# EAGLE design OSO-SWAT-A1-0xA (EAGLE 9.4.2)
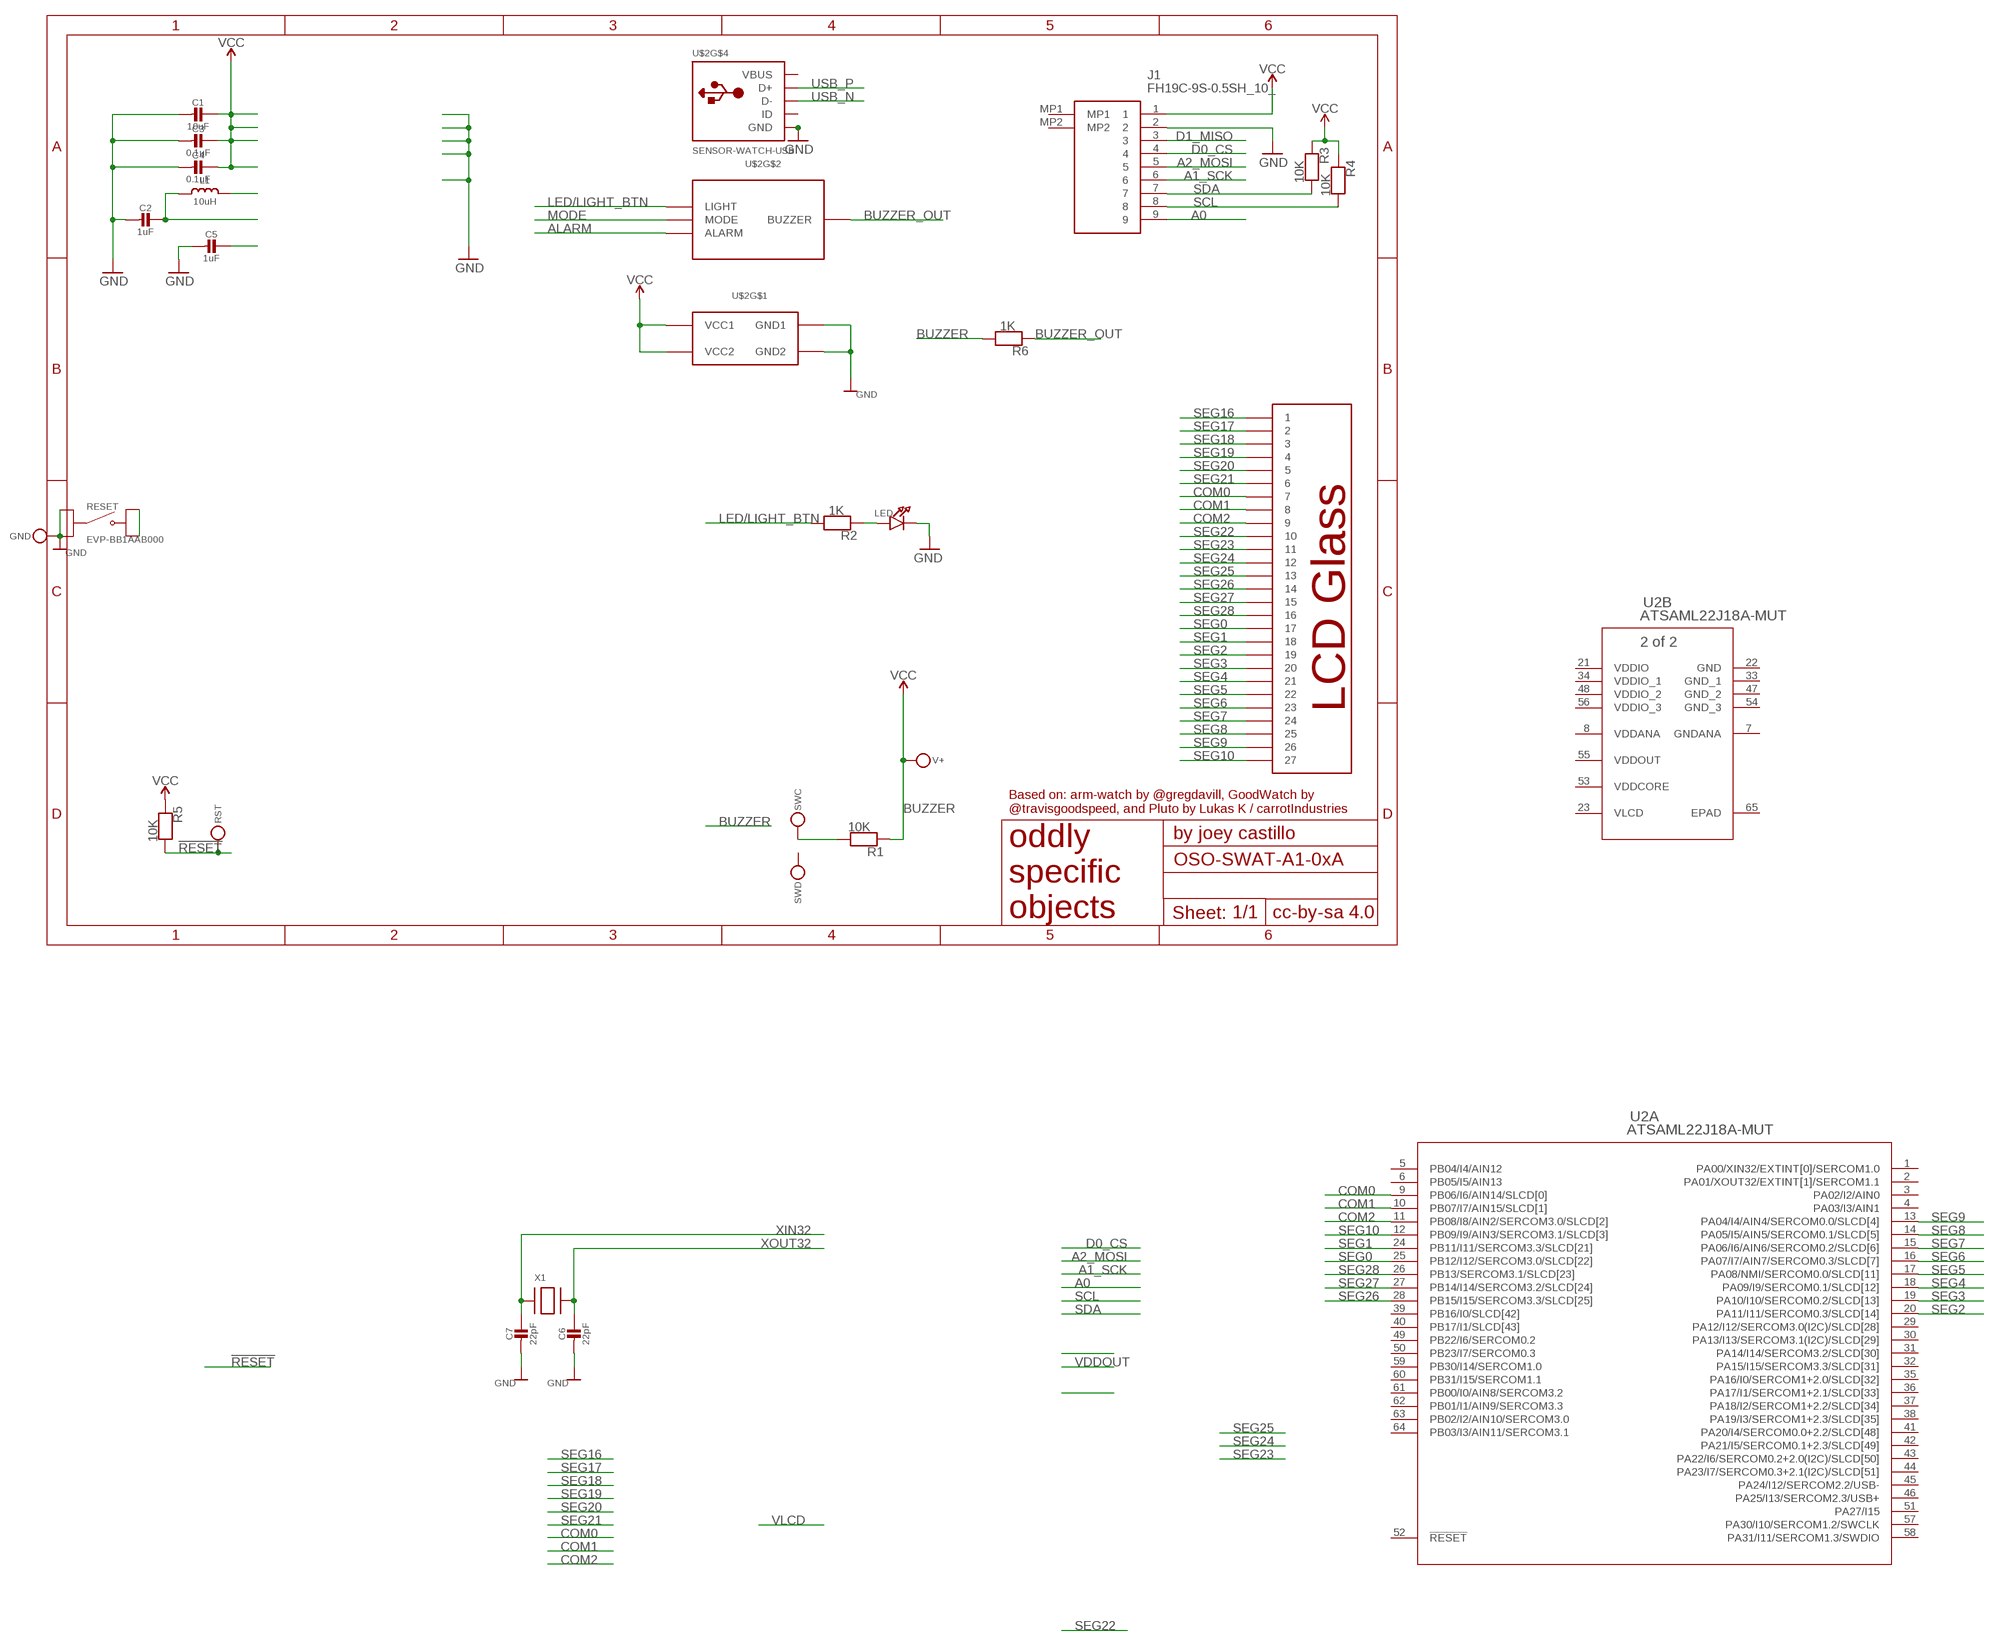
[diagram p0: schematic, sheet 1]

## Parts
C1  10uF  CAP_CERAMIC_0603MP  [_0603MP]
C2  1uF  CAP_CERAMIC_0603MP  [_0603MP]
C3  0.1uF  CAP_CERAMIC_0603MP  [_0603MP]
C4  0.1uF  CAP_CERAMIC_0603MP  [_0603MP]
C5  1uF  CAP_CERAMIC_0603MP  [_0603MP]
C6  22pF  CAP_CERAMIC_0603MP  [_0603MP]
C7  22pF  CAP_CERAMIC_0603MP  [_0603MP]
GND  MICROBUILDER_TESTPOINTPAD1MM  [MICROBUILDER_TESTPOINT_PAD_1MM]
J1  FH19C-9S-0.5SH_10_  [FH19C9S05SH10]
L1  10uH  MICROBUILDER_INDUCTOR_0805MP  [MICROBUILDER__0805MP]
LED  LED0805_NOOUTLINE  [CHIPLED_0805_NOOUTLINE]
R1  10K  RESISTOR_0603MP  [_0603MP]
R2  1K  RESISTOR_0603MP  [_0603MP]
R3  10K  RESISTOR_0603MP  [_0603MP]
R4  10K  RESISTOR_0603MP  [_0603MP]
R5  10K  RESISTOR_0603MP  [_0603MP]
R6  1K  RESISTOR_0603MP  [_0603MP]
RESET  EVP-BB1AAB000  [SW_EVP-BB1AAB000]
RST  MICROBUILDER_TESTPOINTPAD1MM  [MICROBUILDER_TESTPOINT_PAD_1MM]
SWC  MICROBUILDER_TESTPOINTPAD1MM  [MICROBUILDER_TESTPOINT_PAD_1MM]
SWD  MICROBUILDER_TESTPOINTPAD1MM  [MICROBUILDER_TESTPOINT_PAD_1MM]
U2  ATSAML22J18A-MUT  [QFN64_9X9MC_MCH]
U$2  SENSOR-WATCH-USB  [CASIO-F91W-OUTLINE-USB]
V+  MICROBUILDER_TESTPOINTPAD1MM  [MICROBUILDER_TESTPOINT_PAD_1MM]
X1  XTAL-3.2X1.5  [XTAL3215]

## Nets
!RESET: R5.2 RST.P$1
A0: J1.9
A1_SCK: J1.6
A2_MOSI: J1.5
ALARM: U$2.ALARM
BUZZER: R6.2
BUZZER_OUT: R6.1 U$2.BUZZER
COM0: U2.9(A:PB06/I6/AIN14/SLCD[0]) U$2.7
COM1: U2.10(A:PB07/I7/AIN15/SLCD[1]) U$2.8
COM2: U2.11(A:PB08/I8/AIN2/SERCOM3.0/SLCD[2]) U$2.9
D0_CS: J1.4
D1_MISO: J1.3 RESET.B1 RESET.B2
GND [gnd]: C1.2 C2.2 C3.2 C4.2 C5.2 C6.2 C7.2 GND.P$1 J1.2 LED.C RESET.A1 RESET.A2 U$2.GND U$2.GND1 U$2.GND2
LED/LIGHT_BTN: R2.2 U$2.LIGHT
MODE: U$2.MODE
N$1: LED.A R2.1
SCL: J1.8 R4.2
SDA: J1.7 R3.2
SEG0: U2.25(A:PB12/I12/SERCOM3.0/SLCD[22]) U$2.17
SEG1: U2.24(A:PB11/I11/SERCOM3.3/SLCD[21]) U$2.18
SEG2: U2.20(A:PA11/I11/SERCOM0.3/SLCD[14]) U$2.19
SEG3: U2.19(A:PA10/I10/SERCOM0.2/SLCD[13]) U$2.20
SEG4: U2.18(A:PA09/I9/SERCOM0.1/SLCD[12]) U$2.21
SEG5: U2.17(A:PA08/NMI/SERCOM0.0/SLCD[11]) U$2.22
SEG6: U2.16(A:PA07/I7/AIN7/SERCOM0.3/SLCD[7]) U$2.23
SEG7: U2.15(A:PA06/I6/AIN6/SERCOM0.2/SLCD[6]) U$2.24
SEG8: U2.14(A:PA05/I5/AIN5/SERCOM0.1/SLCD[5]) U$2.25
SEG9: U2.13(A:PA04/I4/AIN4/SERCOM0.0/SLCD[4]) U$2.26
SEG10: U2.12(A:PB09/I9/AIN3/SERCOM3.1/SLCD[3]) U$2.27
SEG16: U$2.1
SEG17: U$2.2
SEG18: U$2.3
SEG19: U$2.4
SEG20: U$2.5
SEG21: U$2.6
SEG22: U$2.10
SEG23: U$2.11
SEG24: U$2.12
SEG25: U$2.13
SEG26: U2.28(A:PB15/I15/SERCOM3.3/SLCD[25]) U$2.14
SEG27: U2.27(A:PB14/I14/SERCOM3.2/SLCD[24]) U$2.15
SEG28: U2.26(A:PB13/SERCOM3.1/SLCD[23]) U$2.16
SWCLK: R1.2 SWC.P$1
USB_N: U$2.USB_N(D-)
USB_P: U$2.USB_P(D+)
VCC [power]: C1.1 C3.1 C4.1 J1.1 R1.1 R3.1 R4.1 R5.1 U$2.VCC1 U$2.VCC2 V+.P$1
VDDCORE: C2.1 L1.1
VDDOUT: L1.2
VLCD: C5.1
XIN32: C7.1 X1.P$1
XOUT32: C6.1 X1.P$2
Unconnected: J1.MP1 J1.MP2 SWD.P$1 U2.1(A:PA00/XIN32/EXTINT[0]/SERCOM1.0) U2.2(A:PA01/XOUT32/EXTINT[1]/SERCOM1.1) U2.3(A:PA02/I2/AIN0) U2.4(A:PA03/I3/AIN1) U2.5(A:PB04/I4/AIN12) U2.6(A:PB05/I5/AIN13) U2.7(B:GNDANA) U2.22(B:GND) U2.23(B:VLCD) U2.29(A:PA12/I12/SERCOM3.0(I2C)/SLCD[28]) U2.30(A:PA13/I13/SERCOM3.1(I2C)/SLCD[29]) U2.31(A:PA14/I14/SERCOM3.2/SLCD[30]) U2.32(A:PA15/I15/SERCOM3.3/SLCD[31]) U2.33(B:GND_1) U2.35(A:PA16/I0/SERCOM1+2.0/SLCD[32]) U2.36(A:PA17/I1/SERCOM1+2.1/SLCD[33]) U2.37(A:PA18/I2/SERCOM1+2.2/SLCD[34]) U2.38(A:PA19/I3/SERCOM1+2.3/SLCD[35]) U2.39(A:PB16/I0/SLCD[42]) U2.40(A:PB17/I1/SLCD[43]) U2.41(A:PA20/I4/SERCOM0.0+2.2/SLCD[48]) U2.42(A:PA21/I5/SERCOM0.1+2.3/SLCD[49]) U2.43(A:PA22/I6/SERCOM0.2+2.0(I2C)/SLCD[50]) U2.44(A:PA23/I7/SERCOM0.3+2.1(I2C)/SLCD[51]) U2.45(A:PA24/I12/SERCOM2.2/USB-) U2.46(A:PA25/I13/SERCOM2.3/USB+) U2.47(B:GND_2) U2.49(A:PB22/I6/SERCOM0.2) U2.50(A:PB23/I7/SERCOM0.3) U2.51(A:PA27/I15) U2.52(A:!RESET) U2.54(B:GND_3) U2.55(B:VDDOUT) U2.57(A:PA30/I10/SERCOM1.2/SWCLK) U2.58(A:PA31/I11/SERCOM1.3/SWDIO) U2.59(A:PB30/I14/SERCOM1.0) U2.60(A:PB31/I15/SERCOM1.1) U2.61(A:PB00/I0/AIN8/SERCOM3.2) U2.62(A:PB01/I1/AIN9/SERCOM3.3) U2.63(A:PB02/I2/AIN10/SERCOM3.0) U2.64(A:PB03/I3/AIN11/SERCOM3.1) U2.65(B:EPAD) U$2.USB_ID(ID)

## Notes on the sheet
- Based on: arm-watch by @gregdavill, GoodWatch by 
  @travisgoodspeed, and Pluto by Lukas K / carrotIndustries

## Power pins joined to a net without a drawn wire
VBUS: U$2.VBUS
VDDANA: U2.8(B:VDDANA)
VDDCORE: U2.53(B:VDDCORE)
VDDIO: U2.21(B:VDDIO)
VDDIO_1: U2.34(B:VDDIO_1)
VDDIO_2: U2.48(B:VDDIO_2)
VDDIO_3: U2.56(B:VDDIO_3)

## Library data of the parts
C1-C7 = microbuilder:CAP_CERAMIC: Ceramic Capacitors For new designs, use the packages preceded by an '_' character since they are more reliable: The following footprints should be used on most boards: _0402 - Standard footprint for regular board layouts _0603 - Standard footprint for regular board layouts _0805 - Standard footprint for regular board layouts _1206 - Standard footprint for regular board layouts For extremely tight-pitch boards where space is at a premium, the following 'micro-pitch' footprints can be used (smaller pads, no silkscreen outline, etc.): _0402MP - Micro-pitch footprint for very dense/compact boards _0603MP - Micro-pitch footprint for very dense/compact boards _0805MP - Micro-pitch footprint for very dense/compact boards _1206MP - Micro-pitch footprint for very dense/compact boards
GND RST SWC SWD V+ = Adafruit Feather M0 Express:MICROBUILDER_TESTPOINT: Test Point Various test points for characterisation and PCB testing TESTPOINT_SMT - Compact Surface Mount Test Point [Digikey: 5016KTR-ND]
J1 = FH19C-9S-0.5SH:FH19C-9S-0.5SH_10_: CONN FFC BOTTOM 9POS 0.50MM R/A Source: Datasheet <https://componentsearchengine.com/Datasheets/1/FH19C-9S-0.5SH(10).pdf>; DESCRIPTION: CONN FFC BOTTOM 9POS 0.50MM R/A; HEIGHT: 1mm; MANUFACTURER_NAME: Hirose; MANUFACTURER_PART_NUMBER: FH19C-9S-0.5SH(10); MOUSER_PART_NUMBER: 798-FH19C9S05SH10; MOUSER_PRICE-STOCK: https://www.mouser.co.uk/ProductDetail/Hirose-Connector/FH19C-9S-05SH10?qs=vnk2wBG9e15bX8eK%2FvDSMA%3D%3D
L1 = Adafruit 3.5in 480x320 FeatherWing:MICROBUILDER_INDUCTOR: Inductors 0603: 10nH Ceramic Inductor - microwire antenna/RF (Digikey: 712-1434-2-ND) 0805: 560nH Ceramic Inductor - RF (Digikey: 553-1047-1-ND) 270nH Ceramic Inductor - Q = 40@250MHz, +-5%, 1 Ohm DC Resistance (Digikey: 535-10506-2-ND) 1007 (2518 Metric) SMT: 10µH 10% 250mOhm 820mA 1007 Inductor (Digikey: 587-2189-1-ND) 22µH 10% 500mOhm 580mA 1007 Inductor (Digikey: 587-2190-1-ND) 47µH 10% 950mOhm 420mA 1007 Inductor (Digikey: 587-2191-1-ND) 47µH 5% 100mOhm 1A 1008 Inductor (Digikey: 732-1816-1-ND) 5.0x5.0mm (Taiyo Yuden NR5040 Series) 6.8µH 20% 2.3A 64mOhm Inductor (Digikey: 587-2374-2-ND) 5.0x5.0mm (TDK VLC5045 Series) 4.7µH 20% 3.3A 34mOhm Inductor (Digikey: 445-6526-1-ND) 6.8µH 20% 2.7A 46mOhm Inductor (Digikey: 445-6527-1-ND) 6.0x6.0mm (TDK VLC6045 Series) 4.7µH 20% 3.8A 27mOhm Inductor (Digikey: 445-6538-2-ND) 6.8µH 20% 3A 41mOhm Inductor (Digikey: 445-6540-1-ND) 6.2µH 30% 2.2A 45mOhm Inductor (Digikey: SRR5028-6R2YCT-ND) - Not TDK VLC6045 but footprint should match 6.0x6.0mm (TDK SLF6045 Series) 6.8uH 30% 2A 33mOhm Inductor (Digikey: 445-4572-1-ND, Mouser: 810-SLF645T6R8N2R0PF) 6.0x6.0mm (Sumida CDRH5D28 Series) 6.2uH 30% 1.8A 45mOhm Inductor (Digikey: 308-1542-1-ND) Taiyo Yuden NR3015T2R2M - 2.2uH 20% 1.5A (Digikey: 587-1648-2-ND, Mouser: 963-NR3015T2R2M) - Used with TI TPS62172 CoilCraft RFID Transponder Coil - MA5532-AE (For use with AS3935 Lightning Sensor) Taiyo Yuden NRH2412T2R2MNGH - 2.2uH 20% 1AA (Digikey: 587-3443-1-ND) - Used with TI LM3671 Vishay IHLP 1.0uH Molded Inductor - 24mOhm DCR, 5A, +/-20%, -55°C-125°C (Digikey: 541-1319-1-ND)
LED = My Stuff:LED: LED 0603 - 0603 Surface Mount Package 2mA: Green LED - Low Power (3.9mcd, 2ma, 1.7Vf) - Digikey: 475-2709-2-ND Orange LED - Low Power (9.8mcd, 2ma, 1.8Vf) - Digikey: 475-1194-2-ND Red LED - Low Power (5mcd, 2ma, 1.8Vf) - Digikey: 475-1195-2-ND Yellow LED - Low Power (7mcd, 2ma, 1.8Vf) - Digikey: 475-1196-2-ND 5mA: Blue LED - Low Power (17mcd, 5ma, 2.9Vf) - Digikey: LNJ937W8CRACT-ND 0805 - 0805 Surface Mount Package 2mA: Red LED (8.8mcd, 2mA, 1.8Vf, Clear) - Low Power [Digikey: 475-2510-1-ND] Green LED (5mcd, 2mA, 1.8Vf, Clear) - Low Power [Digikey: 475-2730-1-ND] Yellow LED (11.3mcd, 2mA, 1.8Vf, Clear) - Low Power [Digikey: 475-2555-1-ND] 20mA: Red LED (104mcd, 20mA, Diffused) - LS R976 [Digikey: 475-1278-6-ND] Red LED (12mcd, 20mA, 2.0Vf, Clear) - APT2012EC [Digikey: 754-1128-1-ND] Green LED (15mcd, 20mA, 2.2Vf, Clear) - APT2012GC [Digikey: 754-1131-1-ND] Orange LED (160mcd, 20mA, 2.1Vf, Clear) - APT2012SECK [Digikey: 754-1130-1-ND] 1206 - 1206 Surface Mount Package Green LED (26mcd, 20mA, Diffused) - LG N971 [Digikey: 475-1407-6-ND] Red LED (15mcd, 20mA, Diffused) - LH N974 [Digikey: 475-1416-6-ND] Cree - Cree High-Power Surface Mount LEDs XPEBWT-L1-0000-00D50 - White 111lm 350mA 2.9Vf 6200K 110° XTEAWT-00-0000-00000LEE3 - White 114lm 350mA 2.85Vf 5000K 115° Everlight - Everlight 45-21 Series Surface Mount LEDs 45-21/QK2C-B2832AC2CB2/2T - Warm White 2000mcd 20mA 3.25Vf 3050K 120° 45-21/LK2C-B38452C4CB2/2T - Nuetral White 2000mcd 20mA 3.25Vf 4150K 120° 45-21/LK2C-B50634C6CB2/2T - Cold White 2200mcd 20mA 3.25Vf 5650K 120° PLCC2 Reverse Mount LS T77K-J1L2-1-0-2-R18-Z - Red 11.25mcd 2mA 1.8Vf 630nm 120° LO T77K-L1M2-24-Z - Orange 19.6mcd 2mA 1.8Vf 606nm 120° LY T77K-K2M1-26-Z - Yellow 15.7mcd 2mA 1.8Vf 587nm 120°
R1-R6 = microbuilder:RESISTOR: Resistors For new designs, use the packages preceded by an '_' character since they are more reliable: The following footprints should be used on most boards: _0402 - Standard footprint for regular board layouts _0603 - Standard footprint for regular board layouts _0805 - Standard footprint for regular board layouts _1206 - Standard footprint for regular board layouts For extremely tight-pitch boards where space is at a premium, the following 'micro-pitch' footprints can be used (smaller pads, no silkscreen outline, etc.): _0402MP - Micro-pitch footprint for very dense/compact boards _0603MP - Micro-pitch footprint for very dense/compact boards _0805MP - Micro-pitch footprint for very dense/compact boards _1206MP - Micro-pitch footprint for very dense/compact boards
RESET = EVP-BB1AAB000:EVP-BB1AAB000: SWITCH TACTILE SPST-NO 0.02A 15V; DESCRIPTION: Tactile Switch SPST-NO Top Actuated Surface Mount; DIGI-KEY_PART_NUMBER: P124390CT-ND; MF: Panasonic Electronic Components; MP: EVP-BB1AAB000; PACKAGE: None; PURCHASE-URL: https://pricing.snapeda.com/search/part/EVP-BB1AAB000/?ref=eda
U2 = ATSAML22:ATSAML22J18A-MUT; BUILT_BY: EMA_Molly; COPYRIGHT: Copyright (C) 2018 Accelerated Designs. All rights reserved; MANUFACTURER_PART_NUMBER: ATSAML22J18A-MUT; SOURCELIBRARY: Microchip_2019-08-23_25; VENDOR: Microchip
U$2 = My Stuff:SENSOR-WATCH-USB
X1 = adafruit:XTAL: Low cost SMT crystals, no capacitors included http://www.ladyada.net/library/eagle

## Net classes
0 default: width 0.102 mm
1 power: width 0.254 mm
2 gnd: width 0.254 mm

## Board
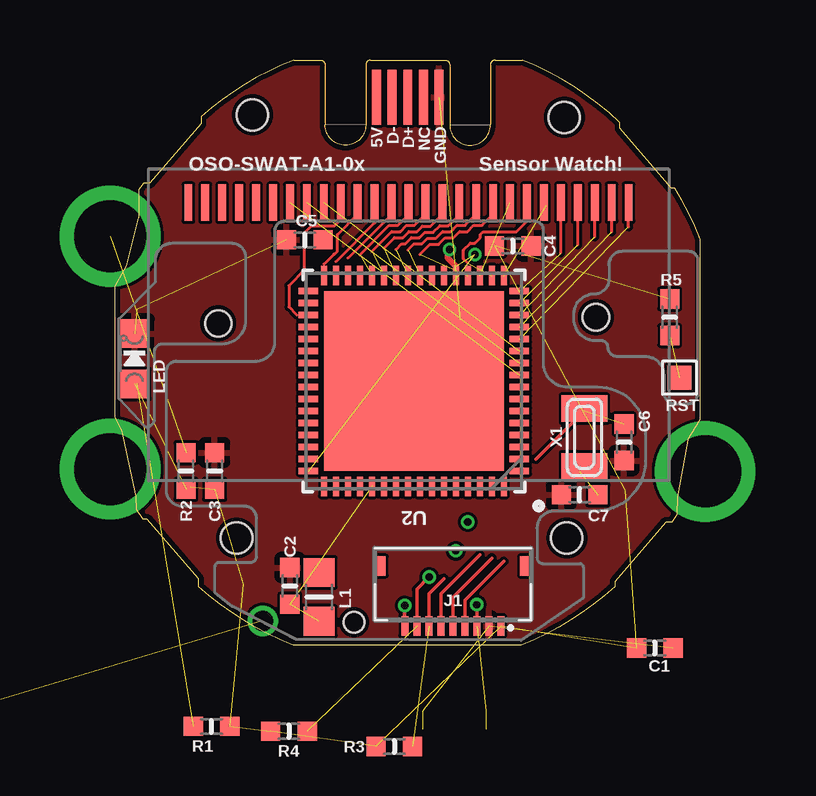
[diagram p1: board, top side]
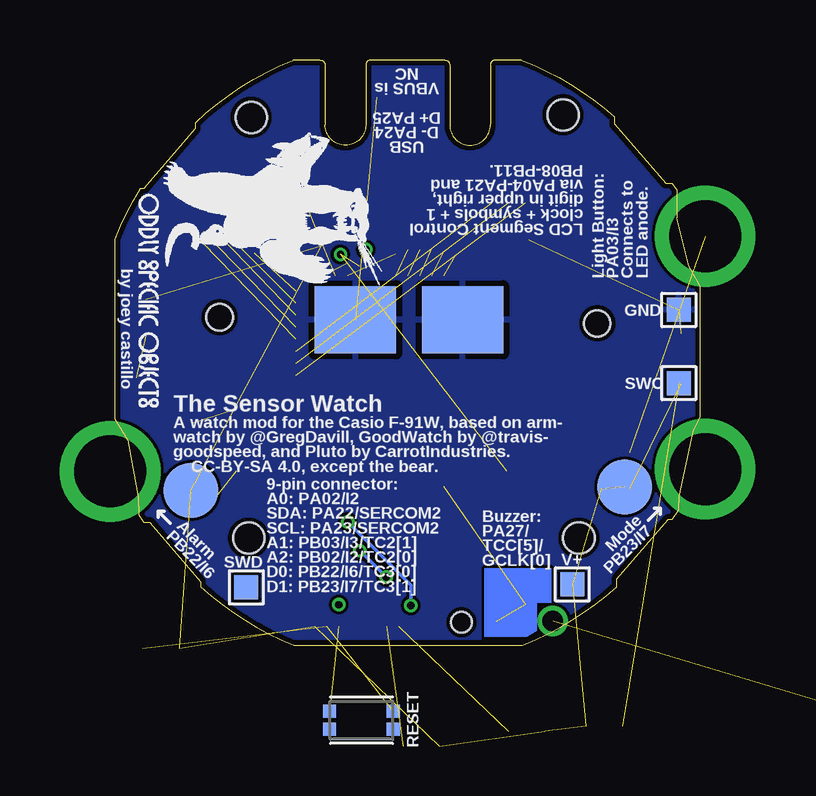
[diagram p2: board, bottom side, seen from below]

Size 24.4 x 24.38 mm. Coordinates in mm from the lower left corner, seen from the top.
Copper layers (1*16): Top 0.035559375mm / dielectric 1.6mm / Bottom 0.035559375mm
Design rules "jlcpcb2layer *": minimum track width 5mil, minimum drill 12mil, track to track 5mil, track to pad 5mil, pad to pad 5mil, via to via 5mil, smd to smd 5mil, copper to edge 8mil, drill to drill 6mil, minimum pad ring 5mil, minimum via ring 5mil, stop-mask expansion 2.5mil, vias tented up to drill 0mil, thermal gap 10mil

### Footprints (pad centres in the part's own frame; a part is rotated, then mirrored left to right if it is on the bottom)
_0603MP = smd 0.8 x 0.8: 1 -0.762,0; 2 0.762,0
MICROBUILDER_TESTPOINT_PAD_1MM = smd 1 x 1: P$1 0,0
FH19C9S05SH10 = smd 0.3 x 0.8: 1 -2,2.5; 2 -1.5,2.5; 3 -1,2.5; 4 -0.5,2.5; 5 0,2.5; 6 0.5,2.5; 7 1,2.5; 8 1.5,2.5; 9 2,2.5 | smd 0.4 x 0.8: MP1 -3,0; MP2 3,0
MICROBUILDER__0805MP = smd 1.2 x 1.3: 1 -1.016,0; 2 1.016,0
CHIPLED_0805_NOOUTLINE = smd 1.2 x 1.2: A 0,-1.05; C 0,1.05
SW_EVP-BB1AAB000 = smd 0.55 x 0.55: A1 -1.325,0.375; A2 -1.325,-0.375; B1 1.325,0.375; B2 1.325,-0.375
QFN64_9X9MC_MCH = smd 0.813 x 0.254: 1 -4.394,3.75; 2 -4.394,3.25; 3 -4.394,2.75; 4 -4.394,2.25; 5 -4.394,1.75; 6 -4.394,1.25; 7 -4.394,0.75; 8 -4.394,0.25; 9 -4.394,-0.25; 10 -4.394,-0.75; 11 -4.394,-1.25; 12 -4.394,-1.75; 13 -4.394,-2.25; 14 -4.394,-2.75; 15 -4.394,-3.25; 16 -4.394,-3.75; 33 4.394,-3.75; 34 4.394,-3.25; 35 4.394,-2.75; 36 4.394,-2.25; 37 4.394,-1.75; 38 4.394,-1.25; 39 4.394,-0.75; 40 4.394,-0.25; 41 4.394,0.25; 42 4.394,0.75; 43 4.394,1.25; 44 4.394,1.75; 45 4.394,2.25; 46 4.394,2.75; 47 4.394,3.25; 48 4.394,3.75 | smd 0.254 x 0.813: 17 -3.75,-4.394; 18 -3.25,-4.394; 19 -2.75,-4.394; 20 -2.25,-4.394; 21 -1.75,-4.394; 22 -1.25,-4.394; 23 -0.75,-4.394; 24 -0.25,-4.394; 25 0.25,-4.394; 26 0.75,-4.394; 27 1.25,-4.394; 28 1.75,-4.394; 29 2.25,-4.394; 30 2.75,-4.394; 31 3.25,-4.394; 32 3.75,-4.394; 49 3.75,4.394; 50 3.25,4.394; 51 2.75,4.394; 52 2.25,4.394; 53 1.75,4.394; 54 1.25,4.394; 55 0.75,4.394; 56 0.25,4.394; 57 -0.25,4.394; 58 -0.75,4.394; 59 -1.25,4.394; 60 -1.75,4.394; 61 -2.25,4.394; 62 -2.75,4.394; 63 -3.25,4.394; 64 -3.75,4.394 | smd 7.493 x 7.493: 65 0,0
CASIO-F91W-OUTLINE-USB = smd 0.326 x 1.52: 1 -9.148,6.25; 2 -8.442,6.25; 3 -7.736,6.25; 4 -7.03,6.25; 5 -6.324,6.25; 6 -5.618,6.25; 7 -4.912,6.25; 8 -4.206,6.25; 9 -3.5,6.25; 10 -2.794,6.25; 11 -2.088,6.25; 12 -1.382,6.25; 13 -0.676,6.25; 14 0.03,6.25; 15 0.736,6.25; 16 1.442,6.25; 17 2.148,6.25; 18 2.854,6.25; 19 3.56,6.25; 20 4.266,6.25; 21 4.972,6.25; 22 5.678,6.25; 23 6.384,6.25; 24 7.09,6.25; 25 7.796,6.25; 26 8.502,6.25; 27 9.208,6.25 | drill 3 pad 4.2: ALARM 12.4,-4.95; LIGHT -12.4,4.85; MODE -12.4,-4.85 | drill 0.85 pad 1.2: BUZZER -6.045,-11.176 | smd 0.37 x 2.3: GND 1.3,10.644; USB_ID 0.65,10.644; USB_N -0.65,10.644; USB_P 0,10.644; VBUS -1.3,10.644 | smd 3.404 x 2.794 bottom: GND1 -2.286,1.372; GND2 2.184,1.372 | smd 2.286 x 2.286 bottom: VCC1 -9.042,-5.588; VCC2 9.042,-5.74 | hole 0.85: -2.235,-11.227 | hole 1.1: -7.899,1.219; 7.849,1.473 | hole 1.3: -6.477,9.906; 6.528,9.804; 6.629,-7.722; -7.137,-7.722
XTAL3215 = smd 1.1 x 1.9: P$1 1.2,0; P$2 -1.2,0

### Placement (x,y rotation side)
C1  22.5,-0.12 0 top
C2  7.29,2.47 90 top
C3  4.15,7.26 90 top
C4  16.58,16.63 0 top
C5  7.91,16.88 180 top
C6  21.22,8.45 270 top
C7  19.36,6.27 180 top
GND  0.9,13.96 0 bottom
J1  14.08,3.3 180 top
L1  8.5,2.01 90 top
LED  0.81,11.93 0 top
R1  4.02,-3.38 180 top  (outside the outline)
R2  2.95,7.26 90 top
R3  11.64,-4.22 0 top  (outside the outline)
R4  7.25,-3.59 0 top  (outside the outline)
R5  23.12,13.66 270 top
R6  -21.46,-7.5 0 top  (outside the outline)
RESET  14.13,-3.13 180 bottom
RST  23.53,11.14 0 top
SWC  0.9,10.92 0 bottom
SWD  18.93,2.41 0 bottom
U2  12.45,11 180 top
U$2  12.2,12.19 0 top
U$5  [OSO_BEAR_250X360MIL_1000DPI]  17.79,18.15 270 bottom
U$6  [OSO_WORDMARK_ONELINE_350MIL_1000DPI]  22.99,14.34 270 bottom
V+  5.34,2.53 0 bottom
X1  19.57,8.66 270 top

### Tracks (layer width: path | path; a pad name or v marks a point on that pad's centre or on a via)
!RESET  (1 unrouted)
A0  (via drill 0.3)
  Top 0.152: v14.7,5.13 v14.7,5.12 | v12.07,1.64 J1.9
  Bottom 0.152: v14.7,5.12 12.07,2.5 v12.07,1.64
A1_SCK
  Top 0.152: J1.6 13.58,2.14 15.2,3.76
A2_MOSI
  Top 0.152: J1.5 14.08,2 15.7,3.62
BUZZER_OUT  (1 unrouted)
COM0  (1 unrouted)
COM1  (1 unrouted)
COM2  (1 unrouted)
D0_CS
  Top 0.152: J1.4 14.58,1.87 16.2,3.49
D1_MISO  (via drill 0.3)  (2 unrouted)
  Top 0.152: v15.08,1.68 J1.3
GND  (6 unrouted)
  pour Top: 7.37,24.38 17.03,24.38 19.57,23.11 21.09,21.84 23.38,19.04 24.39,17.01 24.39,9.39 23.38,5.33 20.84,2.28 18.3,0.5 17.03,-0.01 7.37,-0.01 5.09,1.01 3.56,2.28 1.02,5.33 0.01,9.39 0.01,14.98 1.02,19.04 3.56,22.09 5.85,23.62
  pour Bottom: 17.03,24.38 7.37,24.38 4.83,23.11 3.31,21.84 1.02,19.04 0.01,17.01 0.01,9.01 0.9,5.45 3.51,2.32 6.1,0.5 7.37,-0.01 17.03,-0.01 19.31,1.01 20.84,2.28 23.38,5.33 24.39,9.39 24.39,17.82 20.84,22.09 18.55,23.62
LED/LIGHT_BTN  (1 unrouted)
N$1  (1 unrouted)
SCL  (via drill 0.3)  (1 unrouted)
  Top 0.152: v14.2,3.94 v14.2,3.93 | v13.09,2.84 12.58,2.33 J1.8
  Bottom 0.152: v14.2,3.93 13.11,2.84 v13.09,2.84
SDA  (1 unrouted)
  Top 0.152: J1.7 13.08,2.14 13.7,2.77
SEG0  (1 unrouted)
  Top 0.127: U$2.17 14.35,17.94 13.89,17.48 13.54,17.48 13.26,17.2 12.91,17.2 12.69,16.98 12.35,16.98 12.1,16.72 11.95,16.72 11.7,16.48
SEG1  (1 unrouted)
  Top 0.127: U$2.18 15.05,17.95 14.59,17.49 14.25,17.49 13.99,17.23 13.66,17.23 13.38,16.95 13.02,16.95 12.79,16.72 12.46,16.72 12.2,16.47
SEG2  (1 unrouted)
  Top 0.127: U$2.19 15.76,17.95 15.3,17.49 14.95,17.49 14.7,17.23 14.36,17.23 14.1,16.97 13.76,16.97 13.48,16.69 13.12,16.69 12.7,16.28
SEG3  (1 unrouted)
SEG4  (1 unrouted)
  Top 0.127: 14.7,15.91 14.53,16.08 14.53,16.47 14.81,16.75 14.99,16.75 15.23,16.98 15.23,17.11 15.34,17.22 16.73,17.22 17.17,17.67 U$2.21
SEG5  (1 unrouted)
  Top 0.127: 17.98,18.33 U$2.22
SEG6  (1 unrouted)
  Top 0.127: 18.58,16.33 U$2.23
SEG7  (1 unrouted)
  Top 0.127: 19.29,16.67 U$2.24
SEG8  (1 unrouted)
  Top 0.127: 20,17.01 U$2.25
SEG9  (1 unrouted)
  Top 0.127: 20.7,17.22 U$2.26
SEG10  (1 unrouted)
  Top 0.127: 21.41,17.42 U$2.27
SEG22
  Top 0.127: 7.58,13.75 7.25,14.09 7.25,14.98 7.91,15.64 7.91,17.19 8.2,17.48 9.15,17.48 9.41,17.73 U$2.10
SEG23
  Top 0.127: U$2.11 10.11,17.95 9.26,17.1 9.26,16.41 9.15,16.29 9.13,16.29 8.7,15.87
SEG24
  Top 0.127: U$2.12 10.82,17.6 9.2,15.98
SEG25
  Top 0.127: U$2.13 11.52,17.94 9.7,16.12
SEG26  (1 unrouted)
  Top 0.127: U$2.14 12.23,17.93 11.79,17.49 11.43,17.49 10.2,16.26
SEG27  (1 unrouted)
  Top 0.127: U$2.15 12.94,17.95 12.47,17.49 12.14,17.49 11.89,17.23 11.53,17.23 10.7,16.4
SEG28  (1 unrouted)
  Top 0.127: U$2.16 13.64,17.94 13.15,17.46 12.8,17.46 12.58,17.23 12.25,17.23 11.99,16.98 11.64,16.98 11.2,16.54
SWCLK  (1 unrouted)
VCC  (10 unrouted)
VDDCORE  (2 unrouted)
VDDIO_2  (via drill 0.3)  (2 unrouted)
  Top 0.254: v13.94,16.48 13.86,16.4 13.86,16.14 14.2,15.79 14.2,15.4
  other vias: 15,16.28
XIN32  (1 unrouted)
  Top 0.152: X1.P$1 19.36,7.25
XOUT32  (1 unrouted)
  Top 0.152: X1.P$2 19.57,9.77 17.55,7.75

### Text on the board
tPlace: 5V / D- / D+ / NC / GND | OSO-SWAT-A1-0x | Sensor Watch!
bPlace: USB / D- PA24 / D+ PA25 / / VBUS is / NC | LCD Segment Control / clock + symbols + 1 / digit in upper right, / via PA04-PA21 and / PB08-PB11. | Light Button: / PA03/I3 / Connects to / LED anode. | by joey castillo | The Sensor Watch | A watch mod for the Casio F-91W, based on arm- / watch by @GregDavill, GoodWatch by @travis- / goodspeed, and Pluto by CarrotIndustries. / CC-BY-SA 4.0, except the bear. | 9-pin connector: / A0: PA02/I2 / SDA: PA22/SERCOM2 / SCL: PA23/SERCOM2 / A1: PB03/I3/TC2[1] / A2: PB02/I2/TC2[0] / D0: PB22/I6/TC3[0] / D1: PB23/I7/TC3[1] | Mode / PB23/I7 | Buzzer: / PA27/ / TCC[5]/ / GCLK[0] | Alarm / PB22/I6